# Altium schematic sheet LVM main.SchDoc: LVM PLC setup
size A3; Author: Felipe Besser P.; CompanyName: Observatorio Las Campanas; DocumentNumber: 1; Revision: 1; SheetNumber: 1; SheetTotal: 3
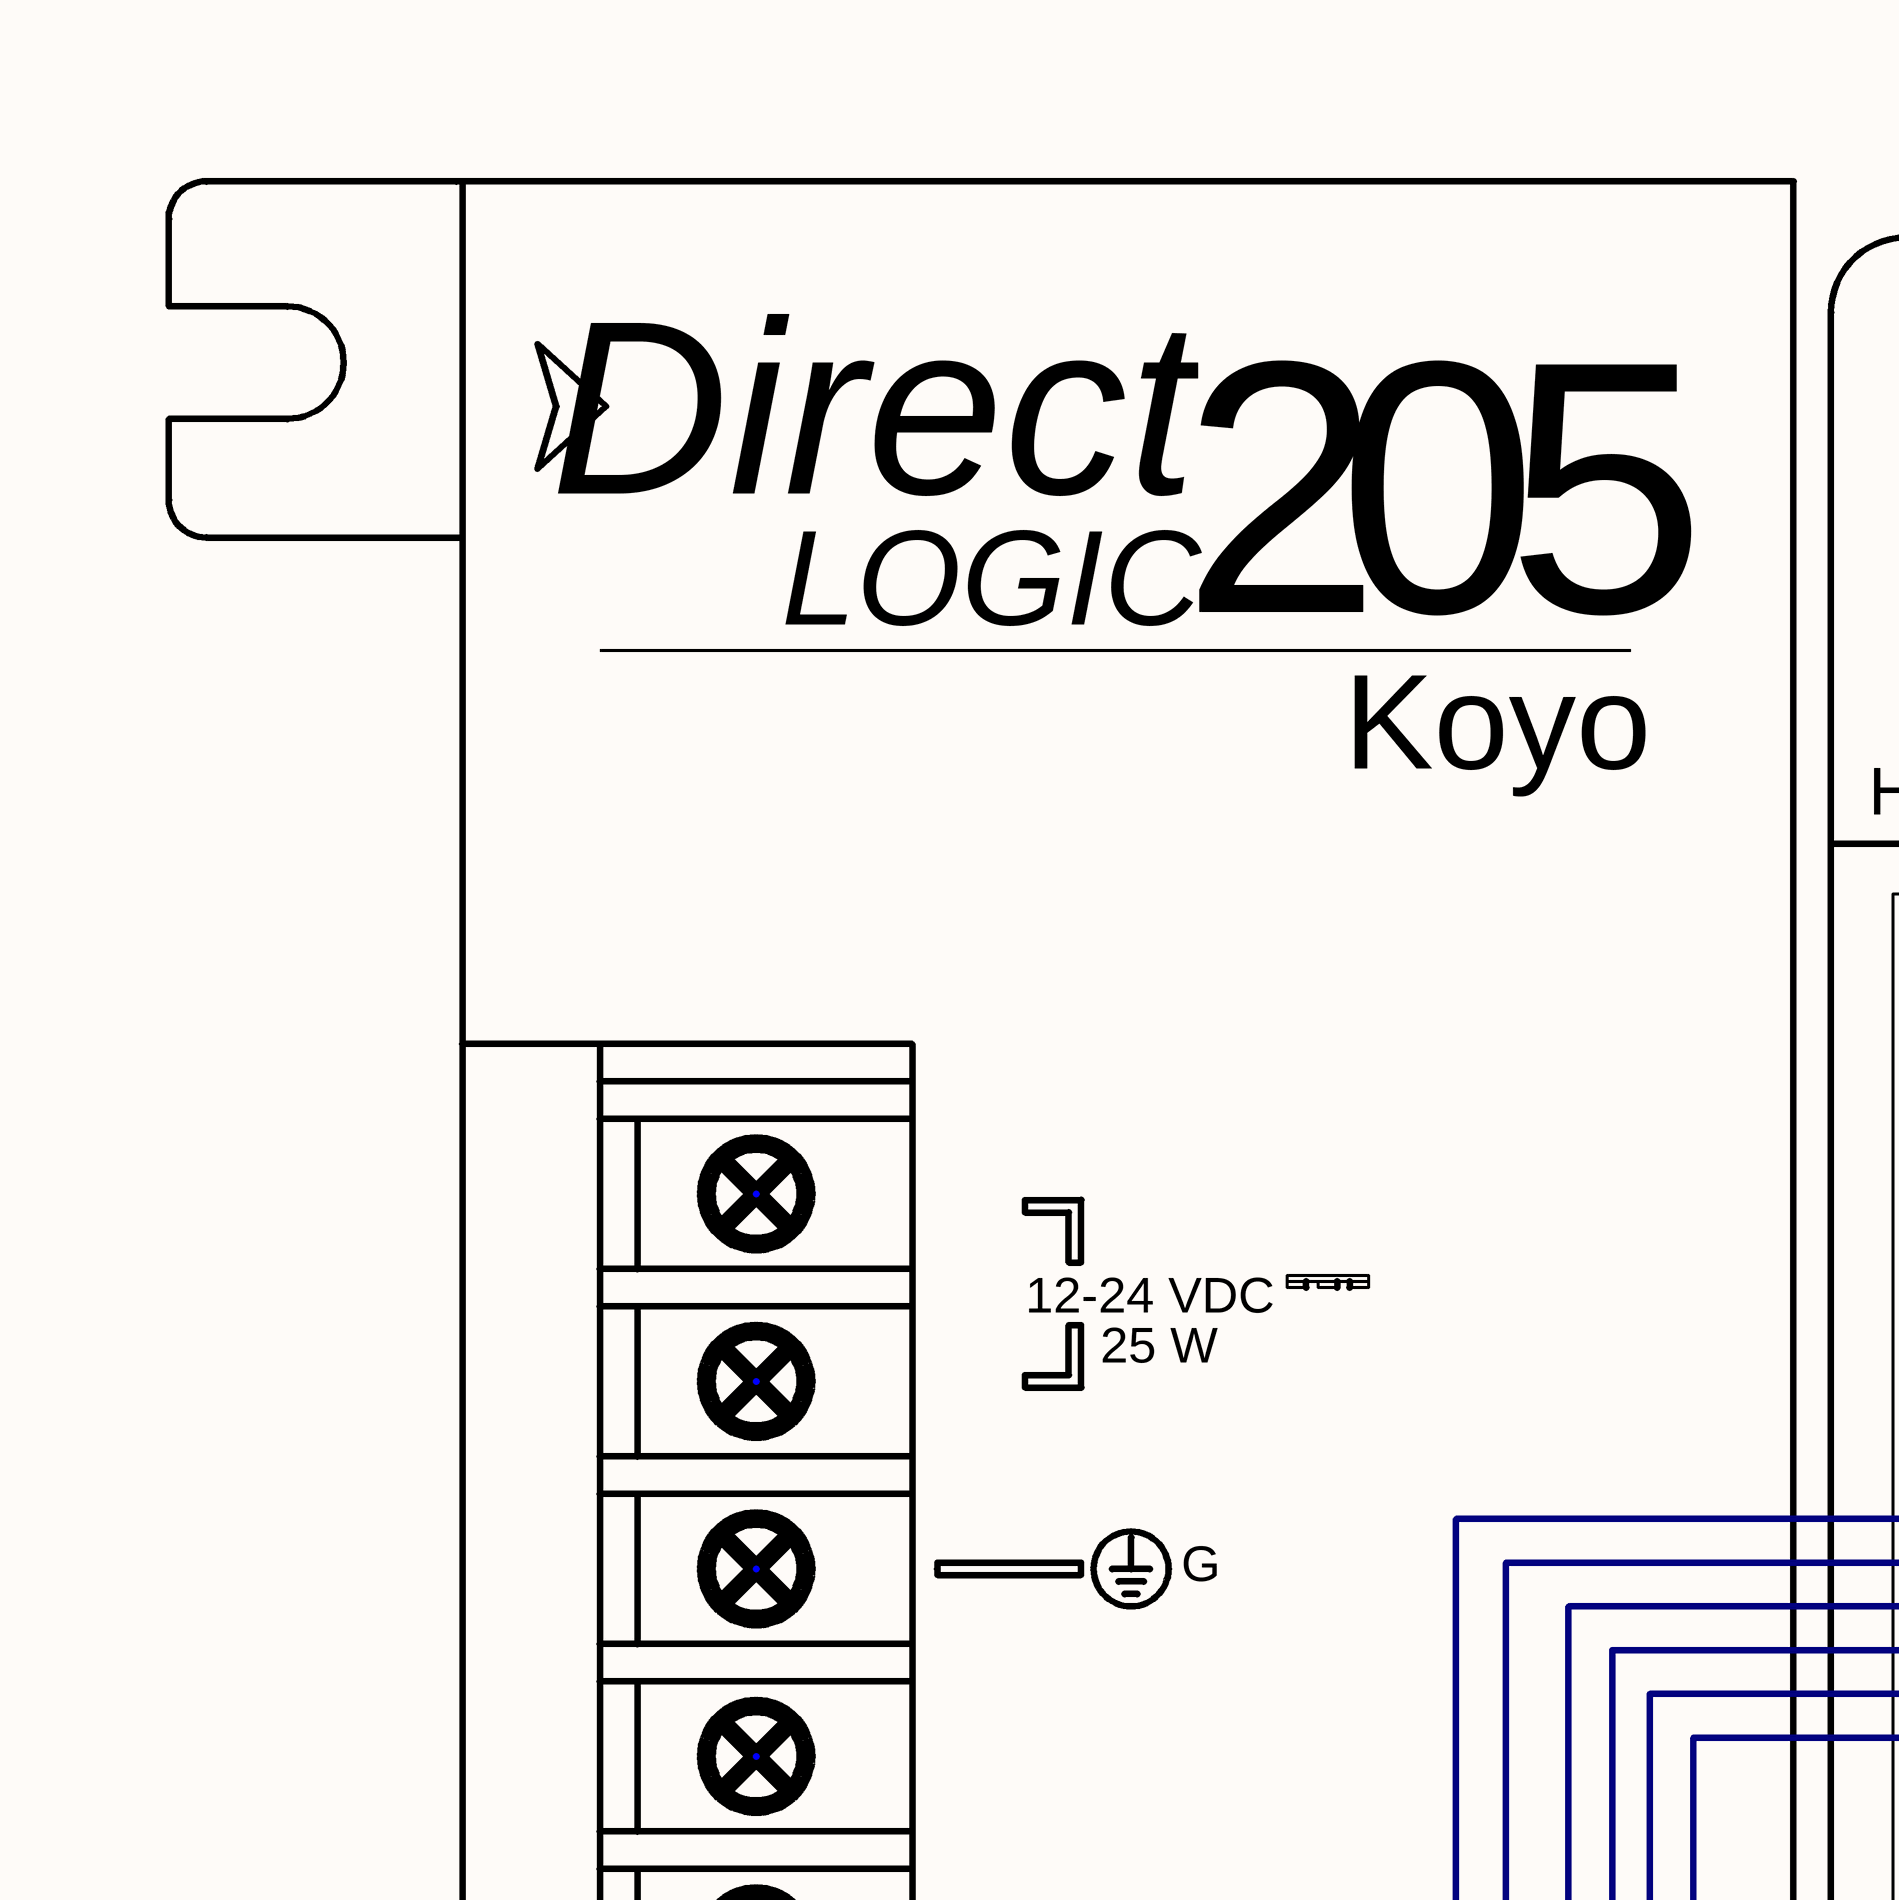
[diagram p0: LVM main.SchDoc, top column 1 of 4]
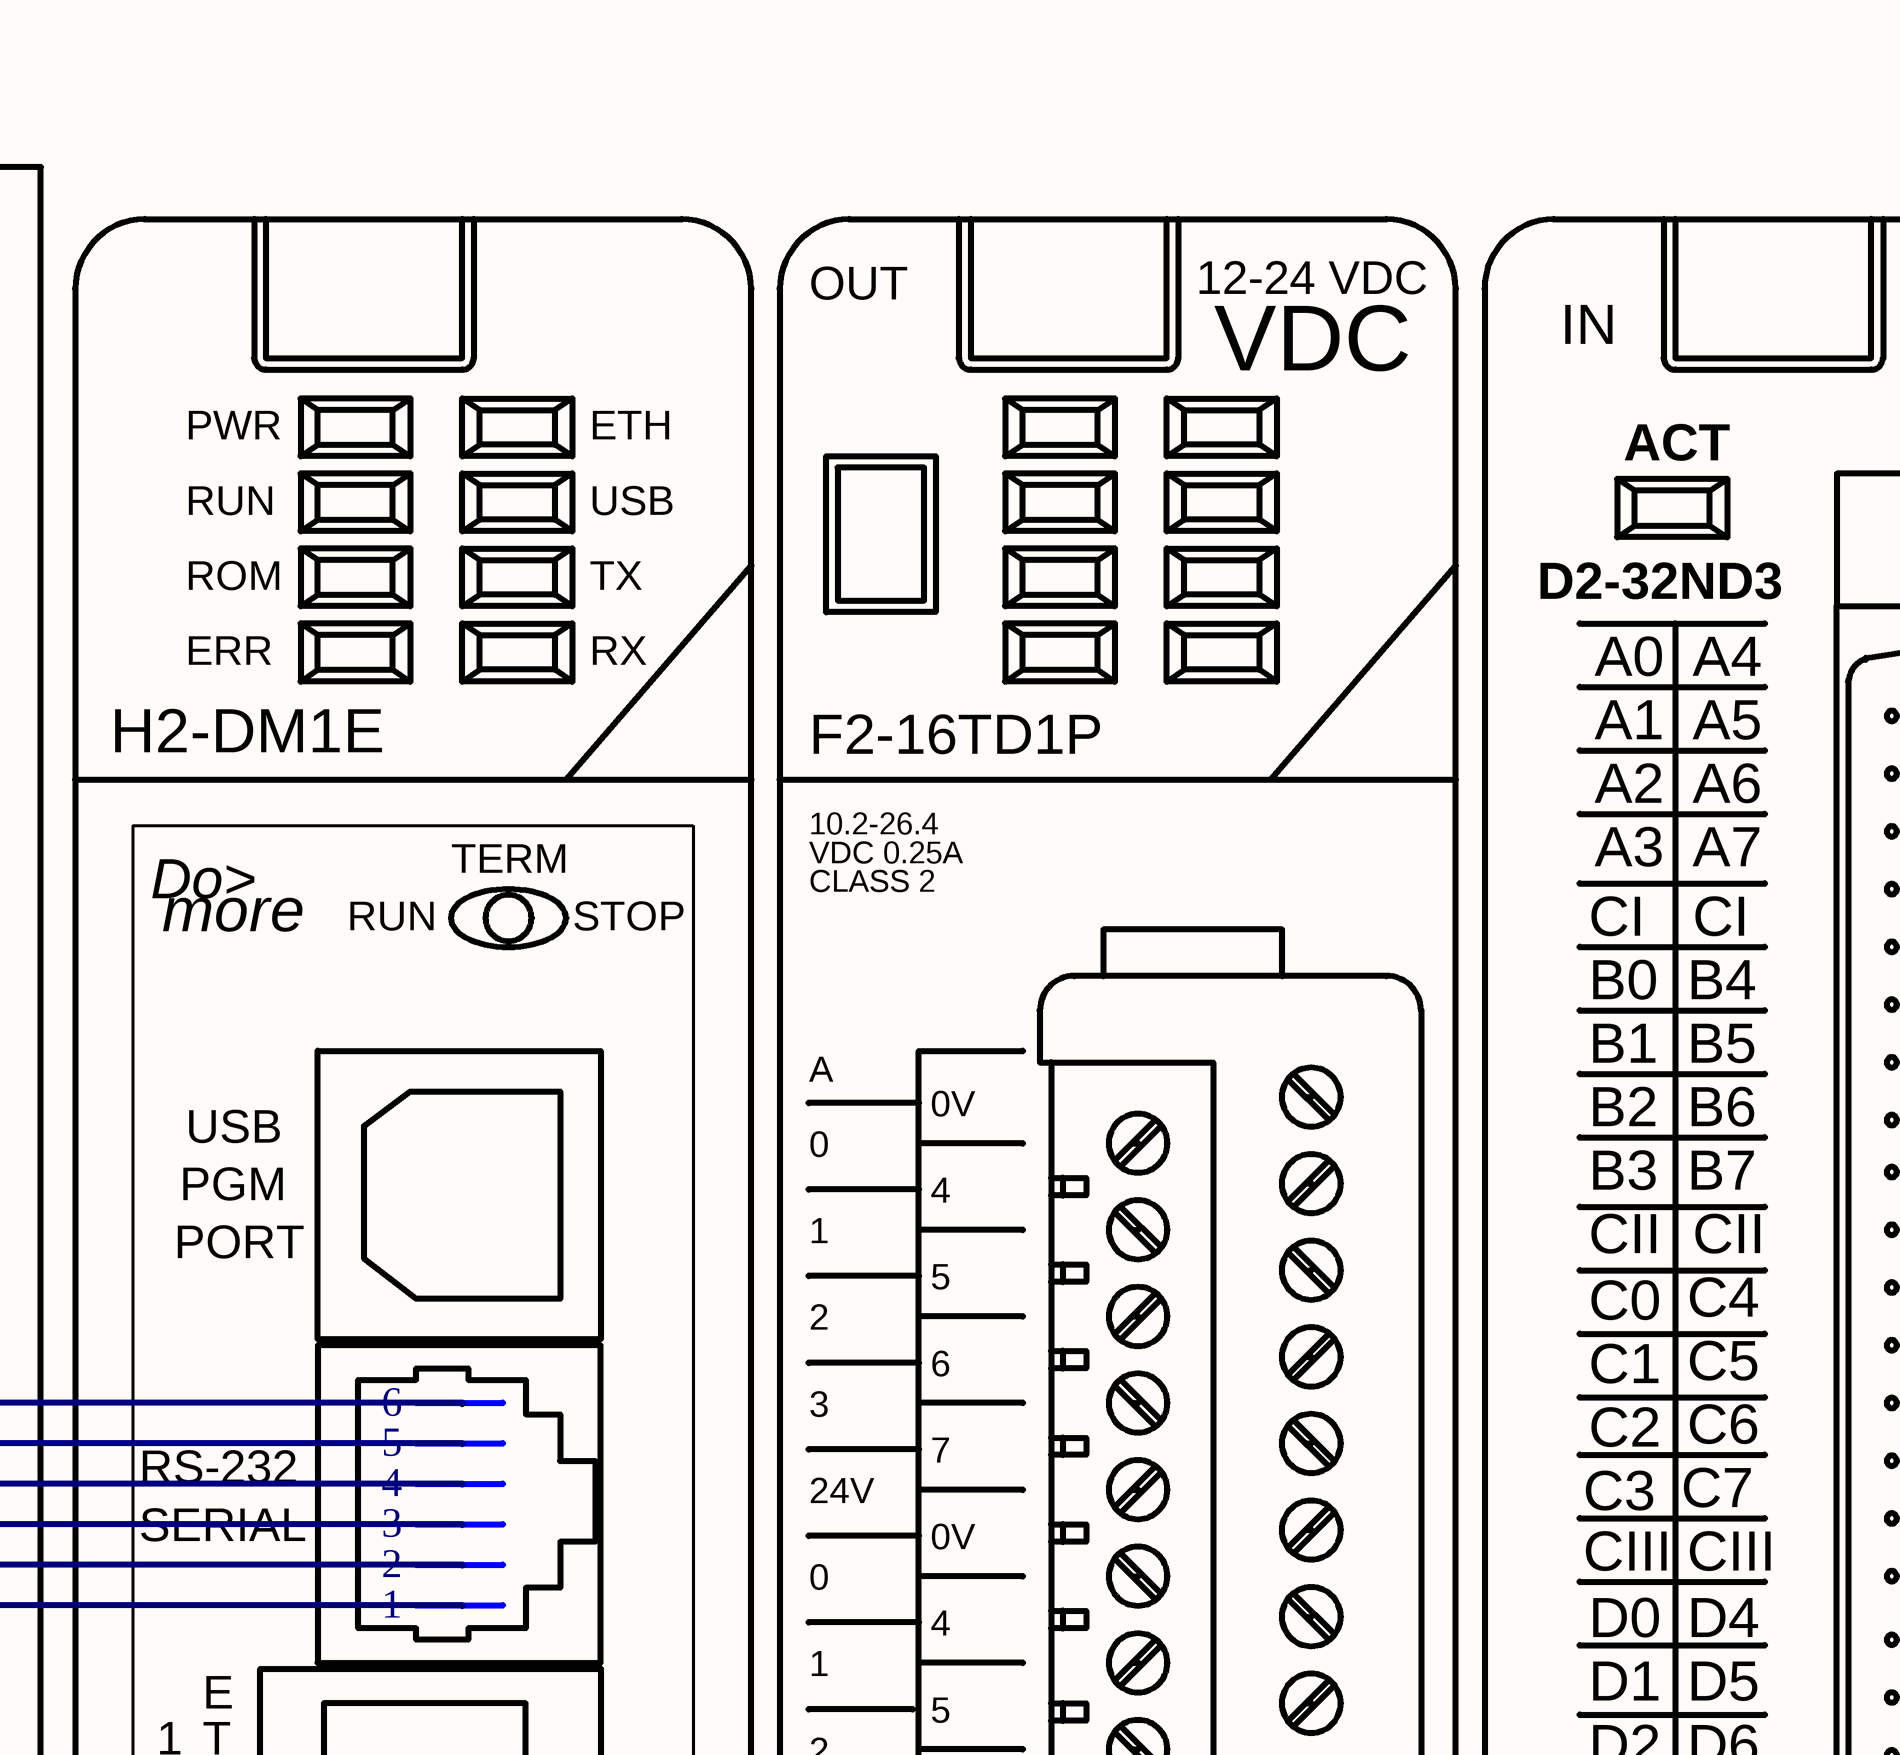
[diagram p1: LVM main.SchDoc, top column 2 of 4]
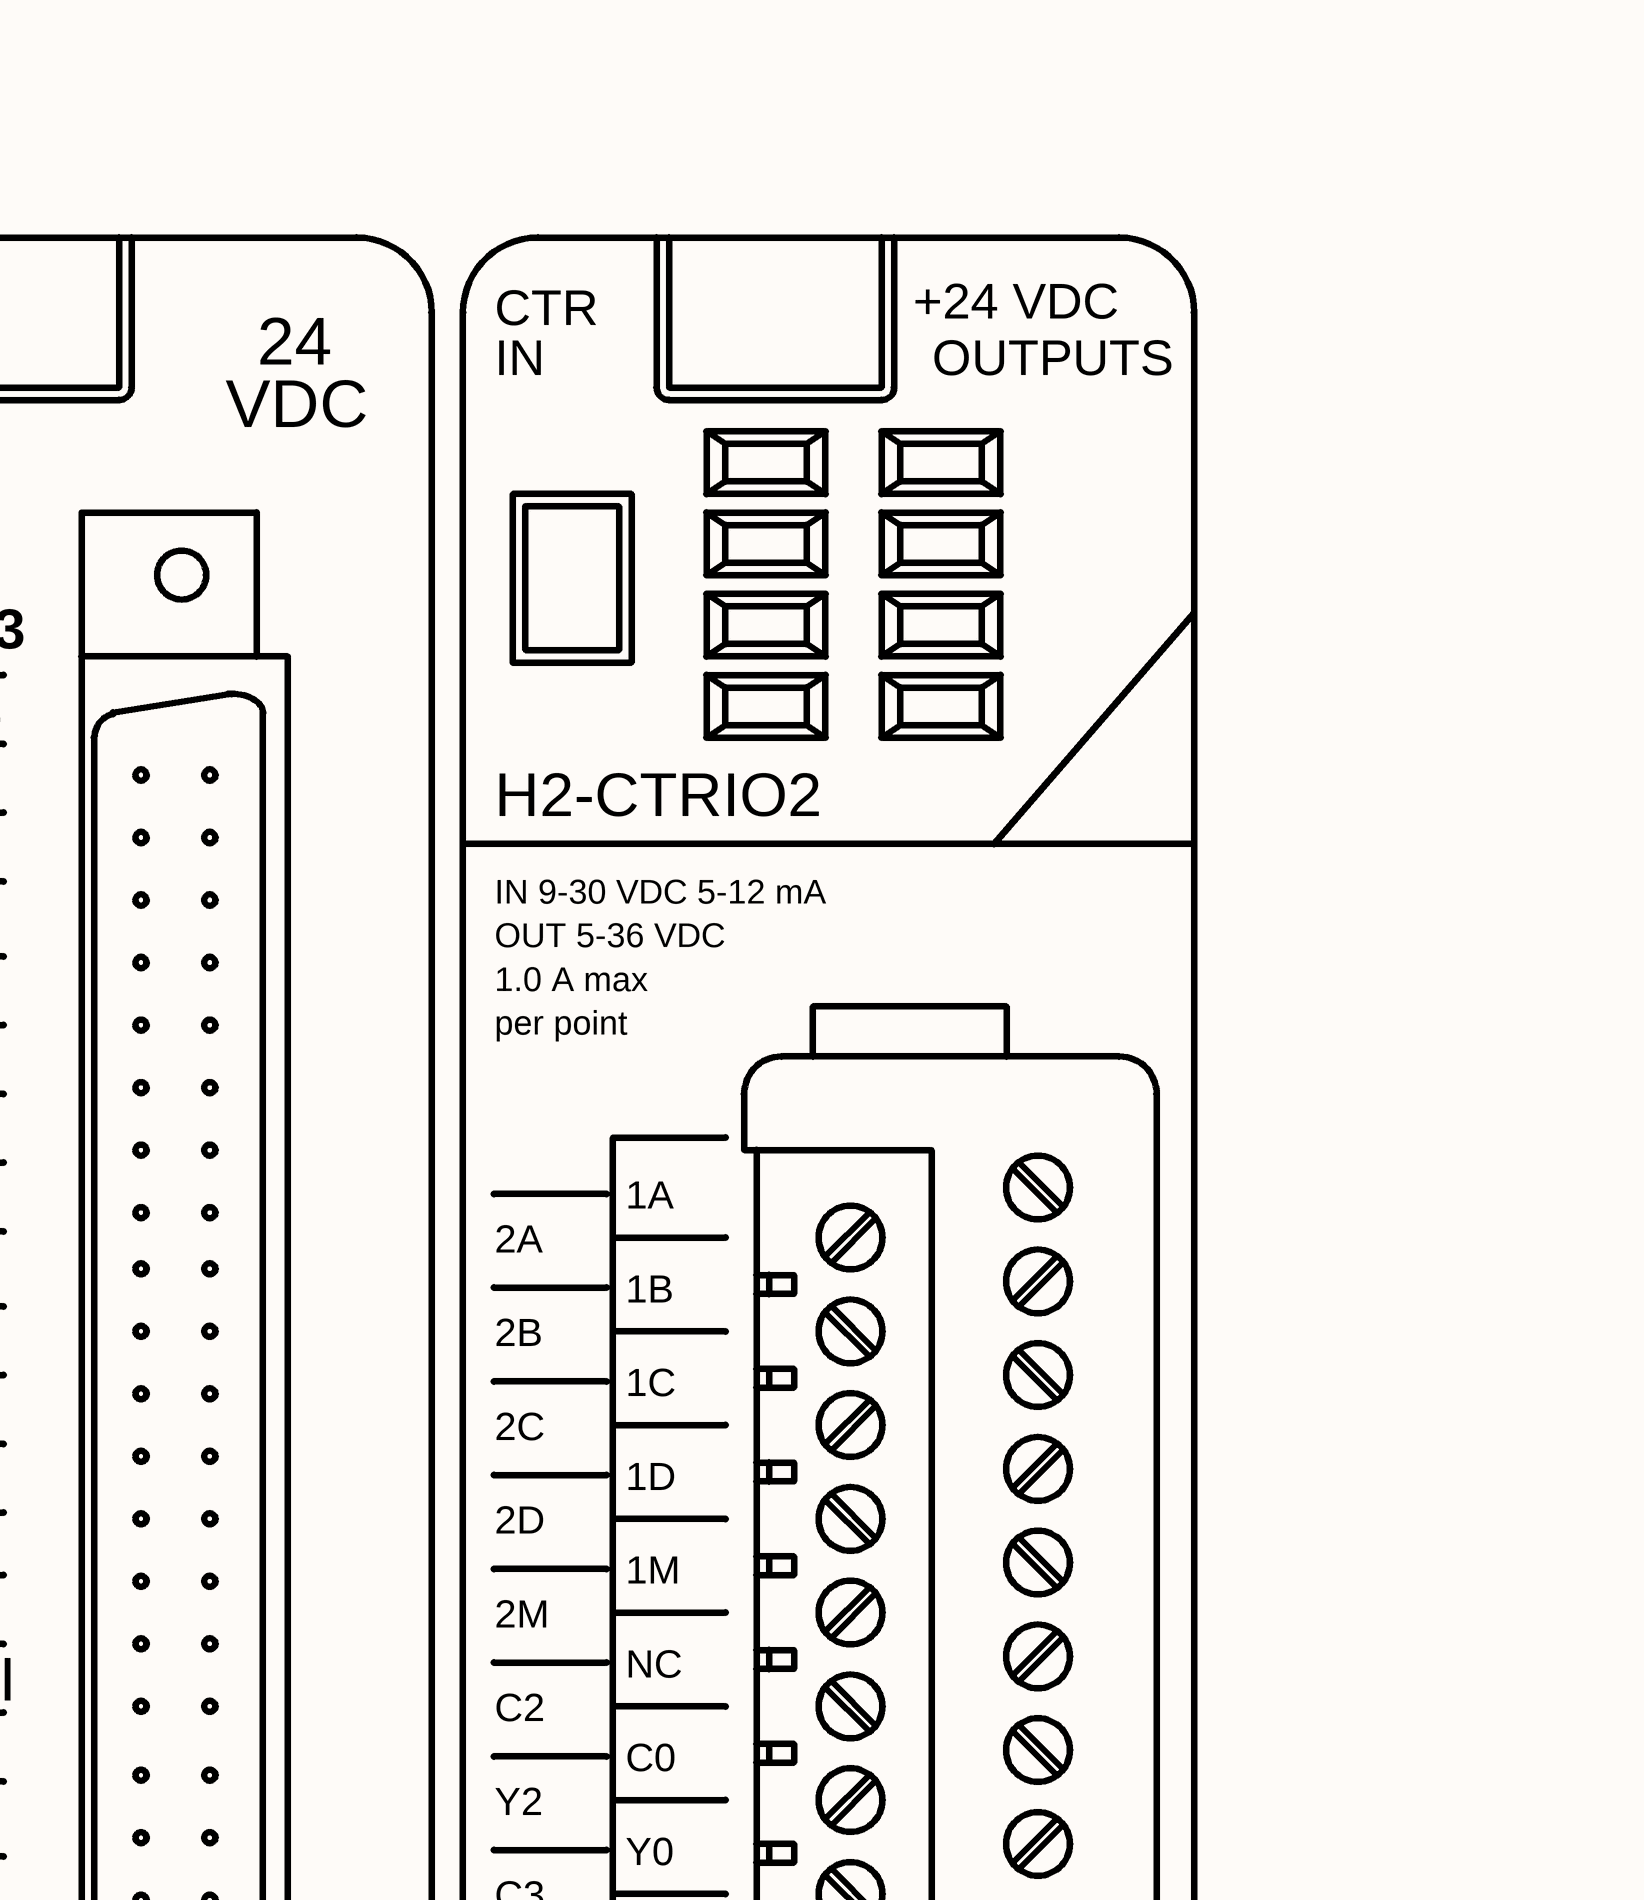
[diagram p2: LVM main.SchDoc, top column 3 of 4]
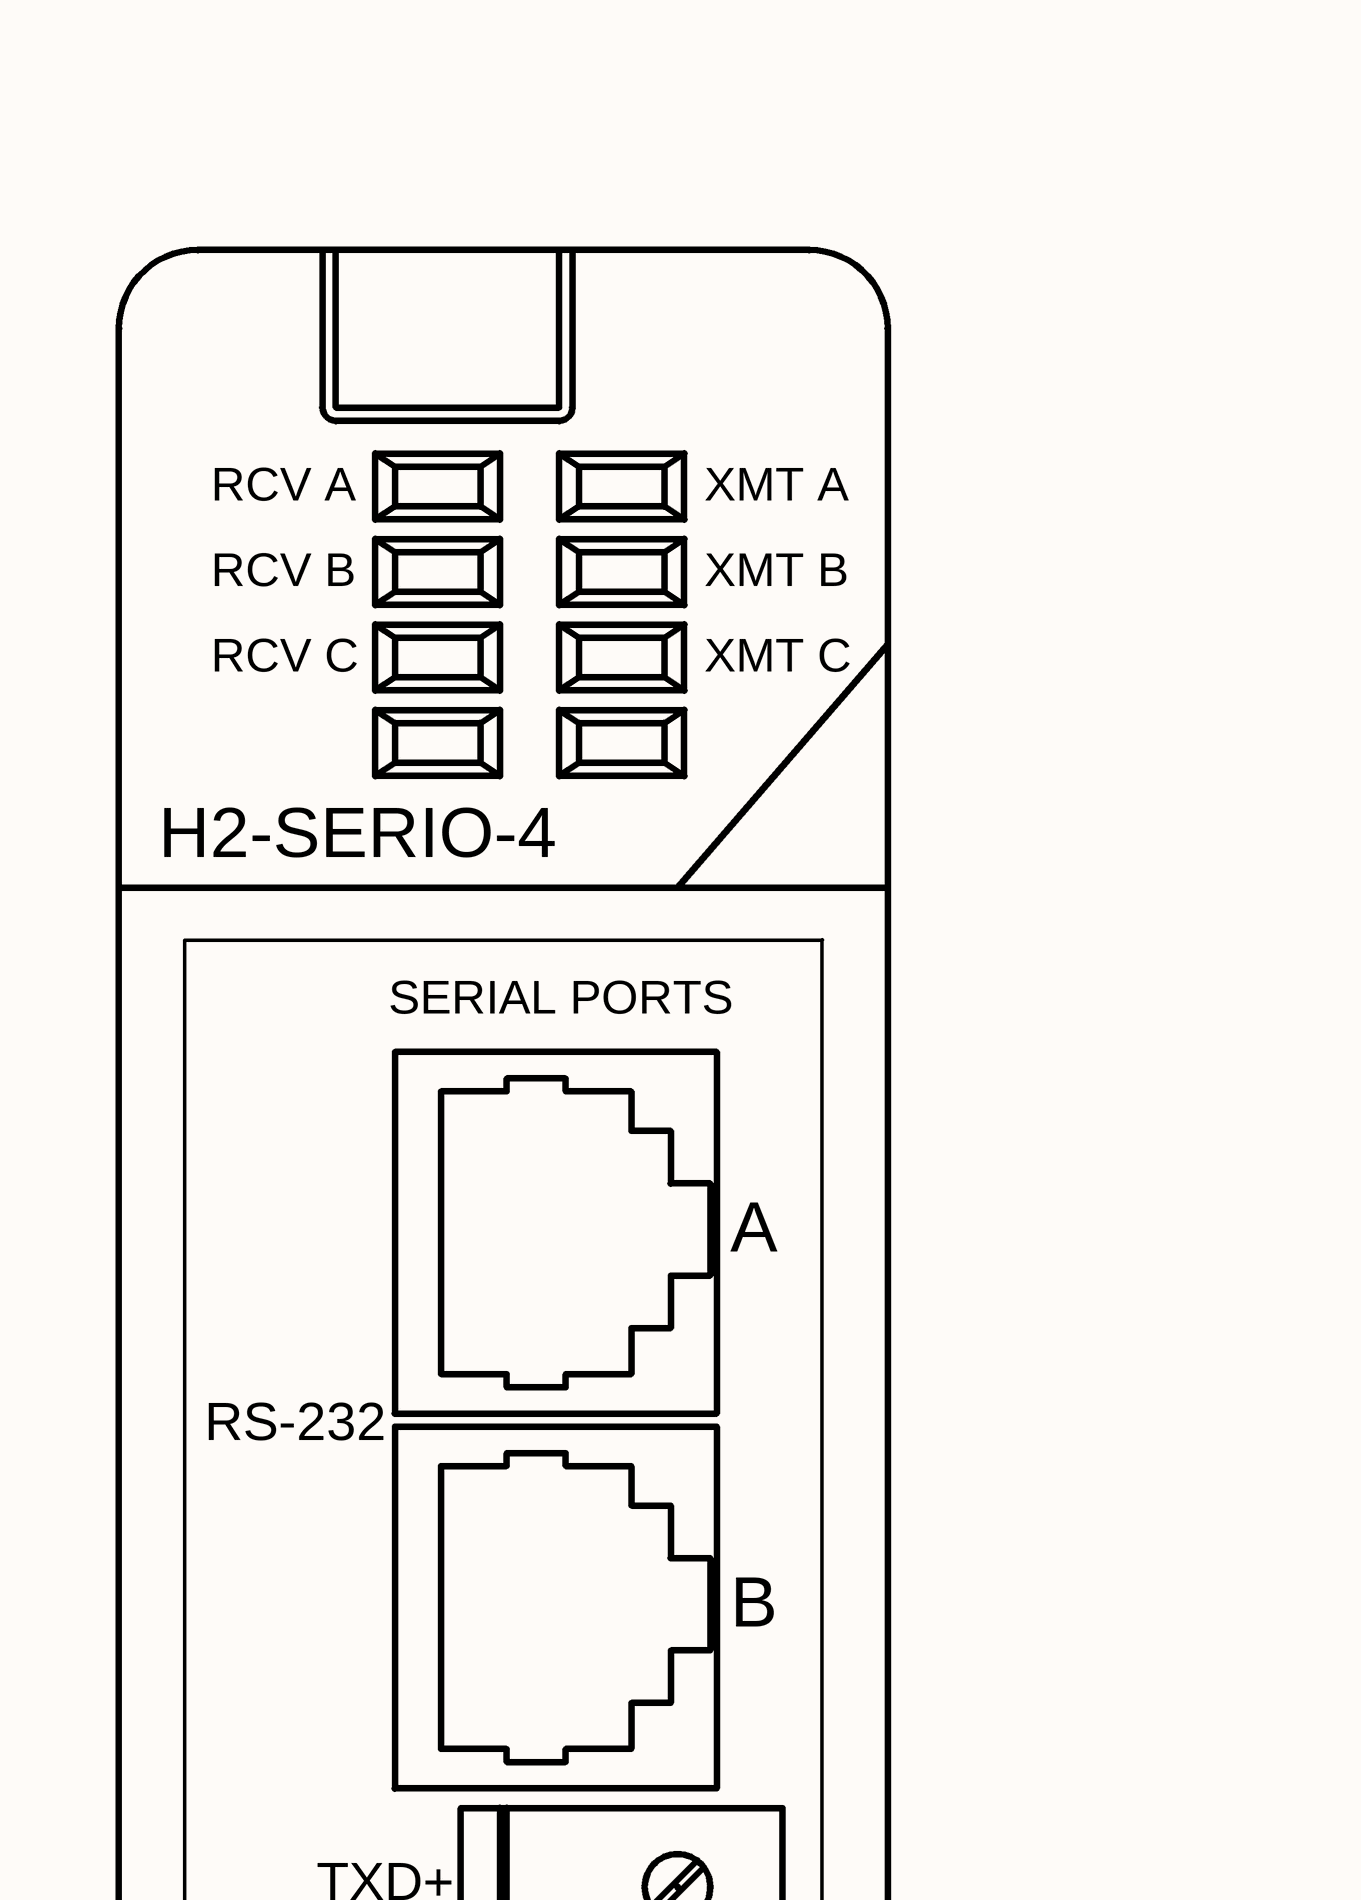
[diagram p3: LVM main.SchDoc, top column 4 of 4]
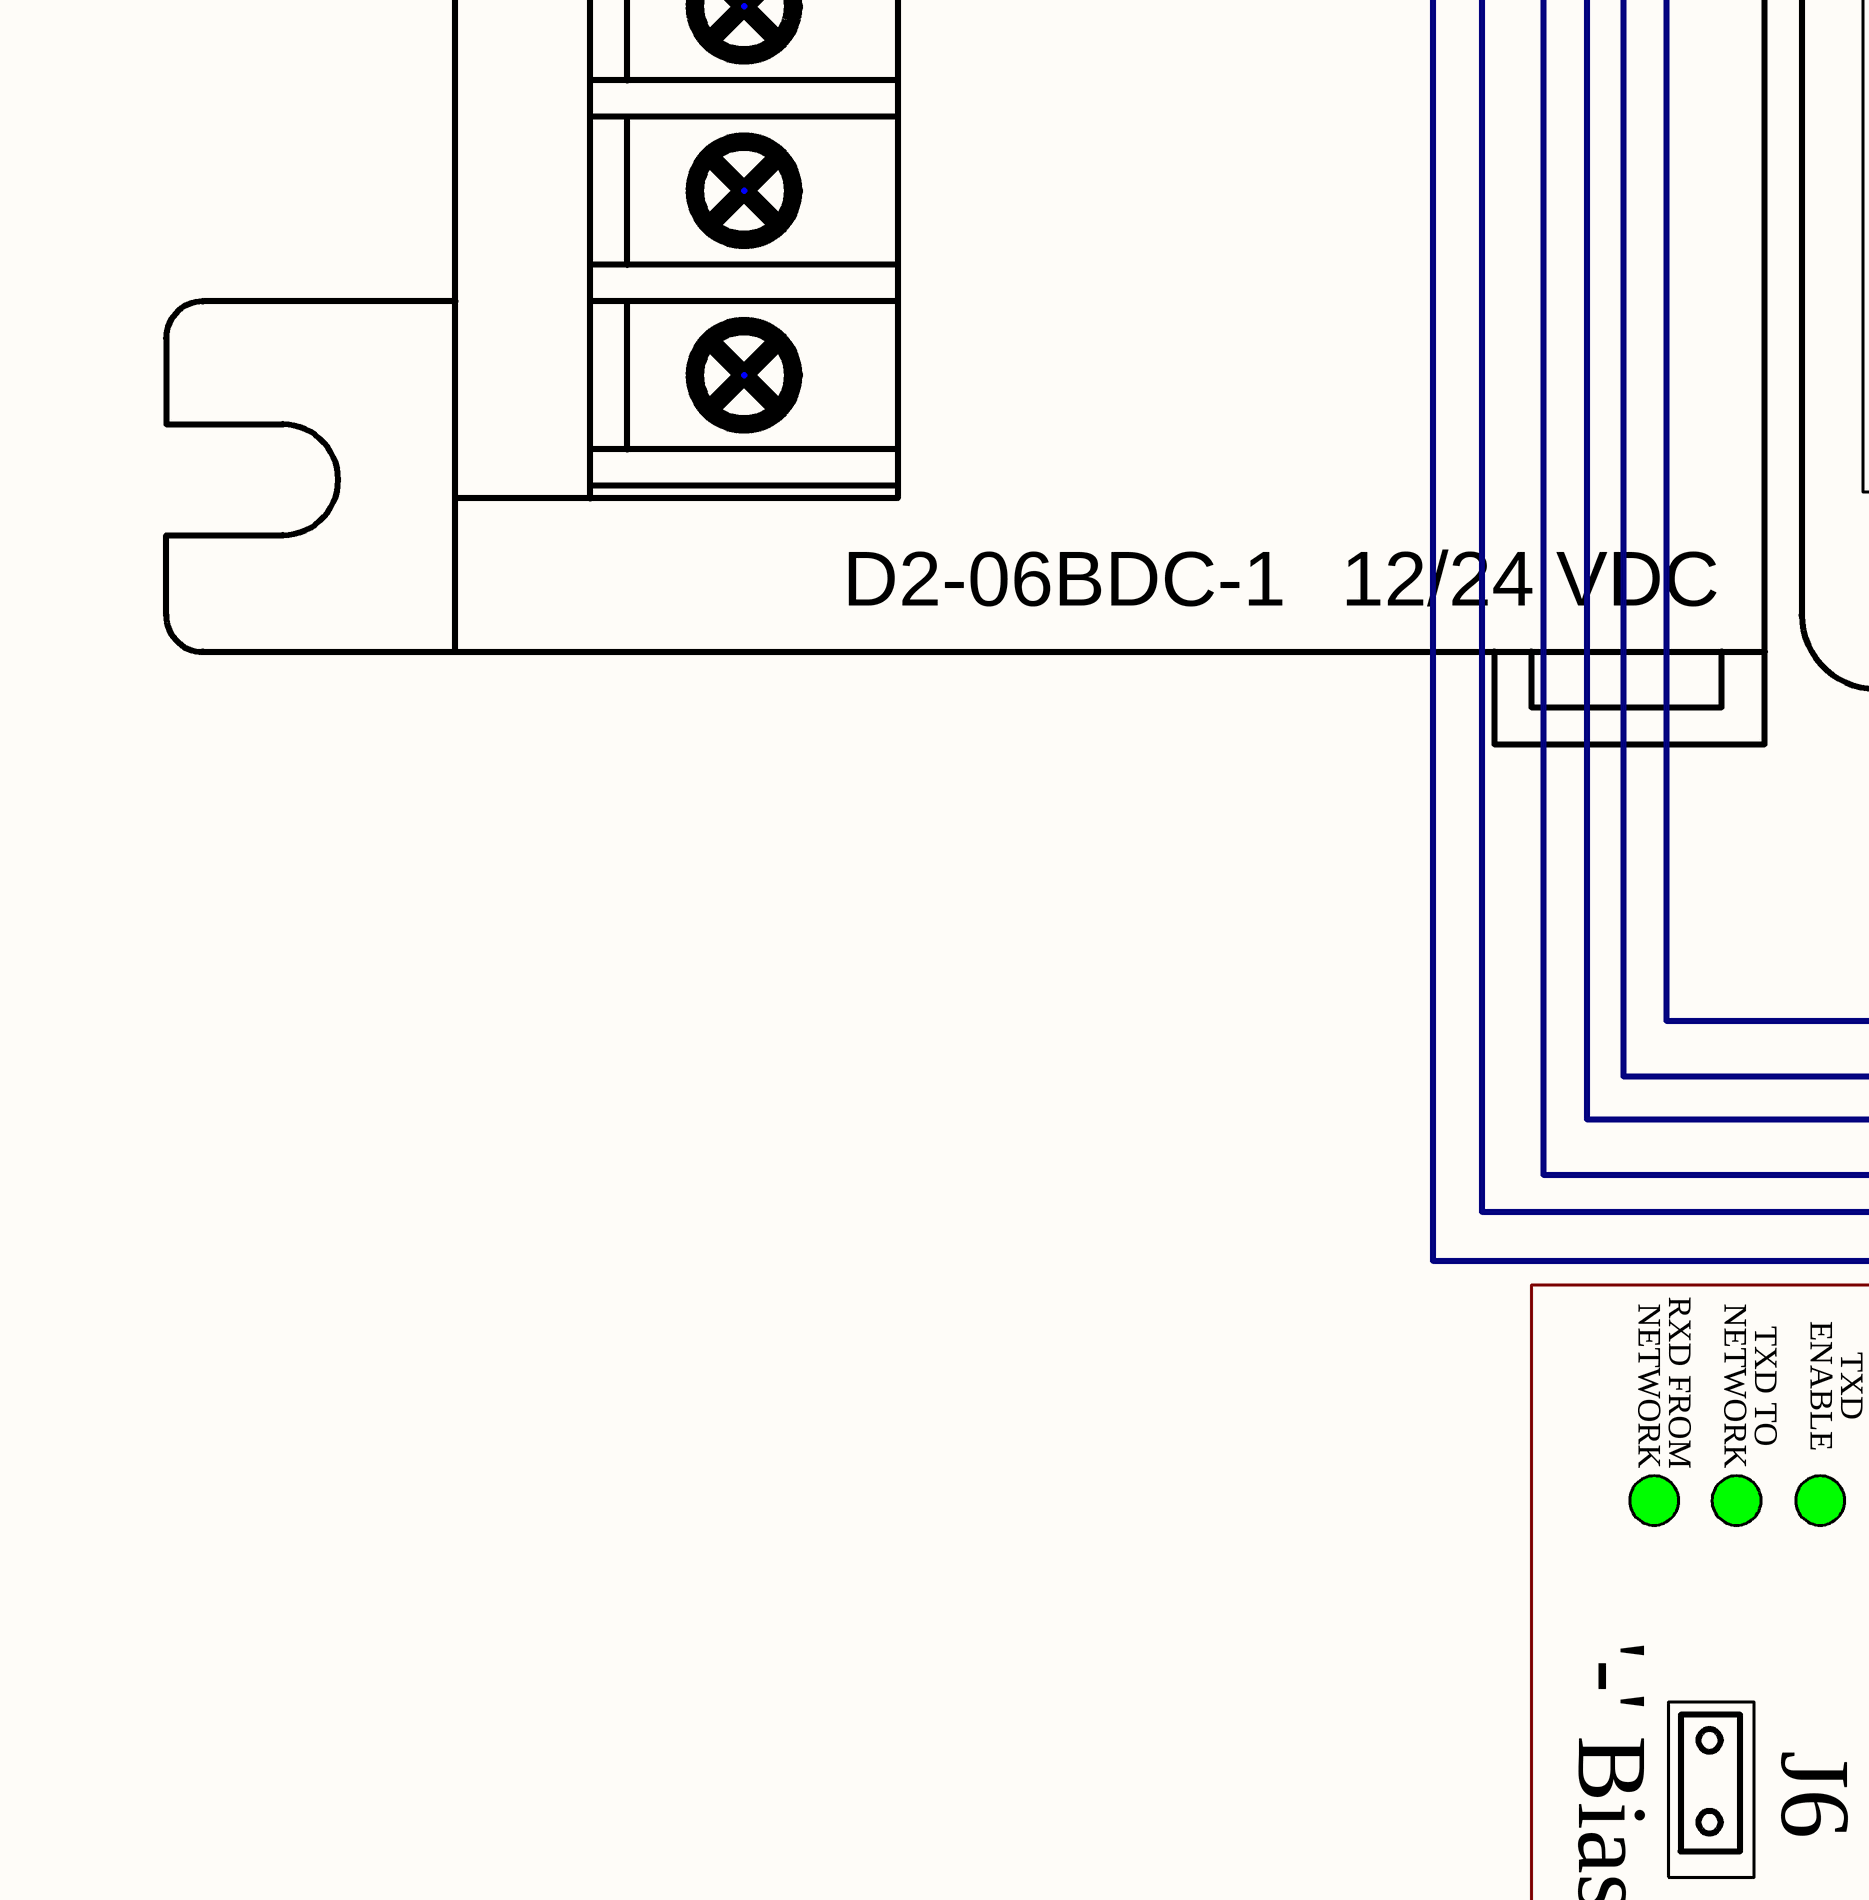
[diagram p4: LVM main.SchDoc, centre column 1 of 4]
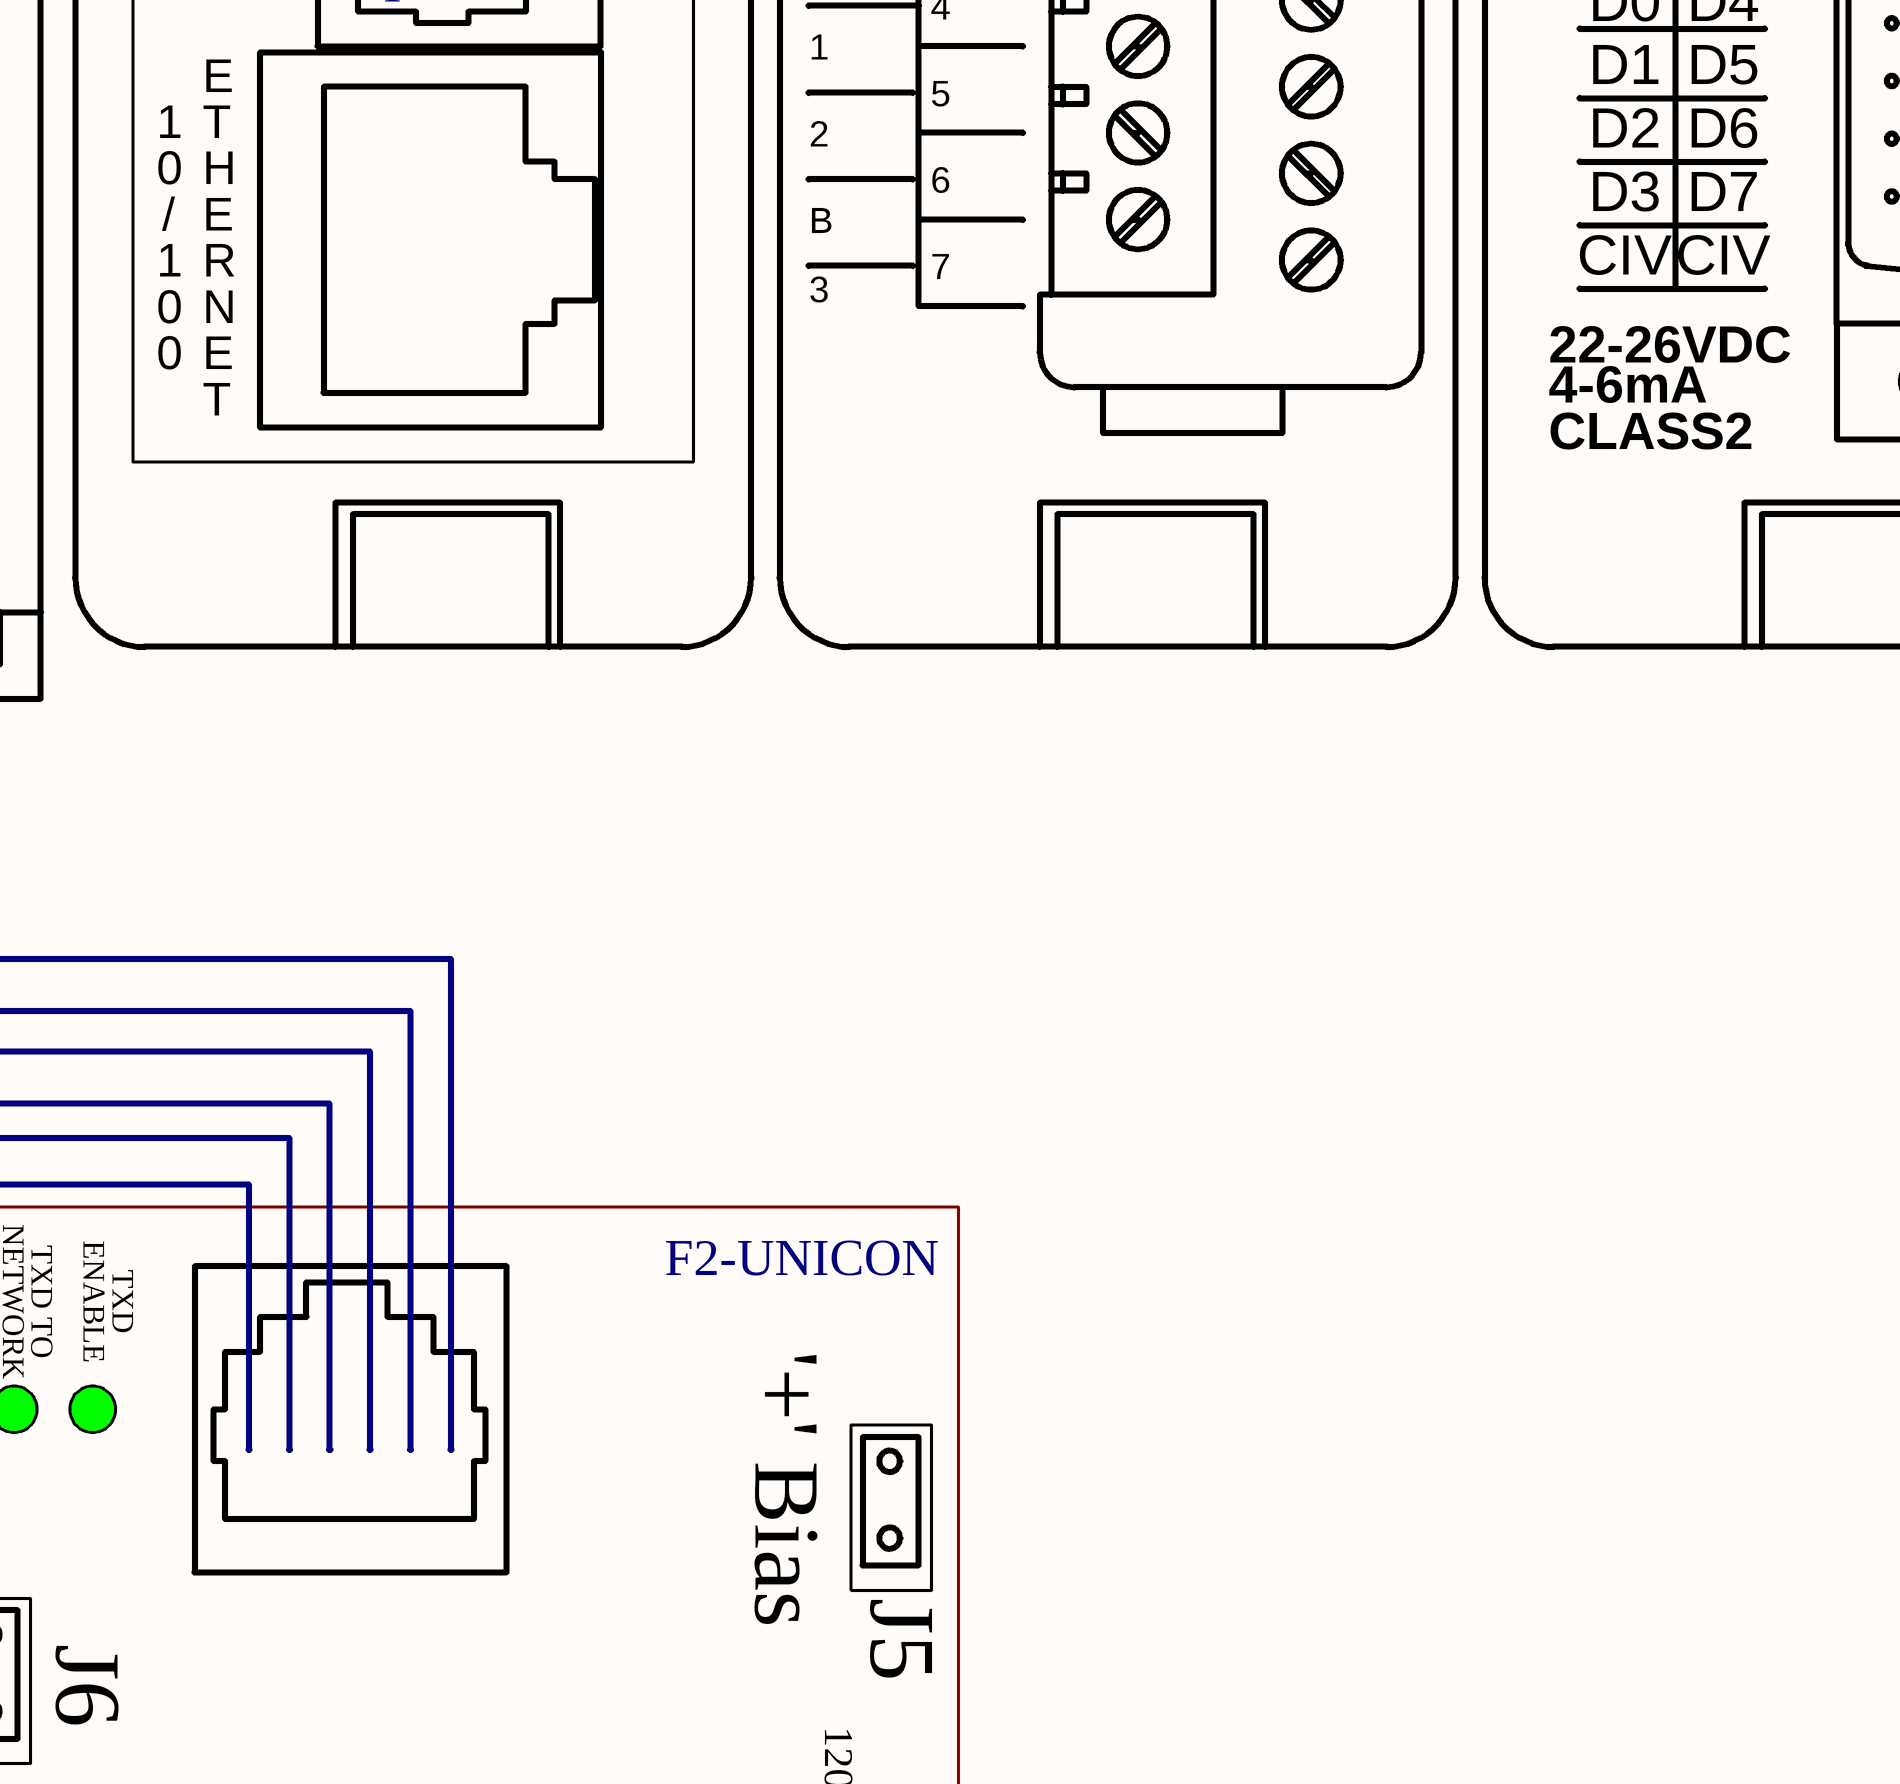
[diagram p5: LVM main.SchDoc, centre column 2 of 4]
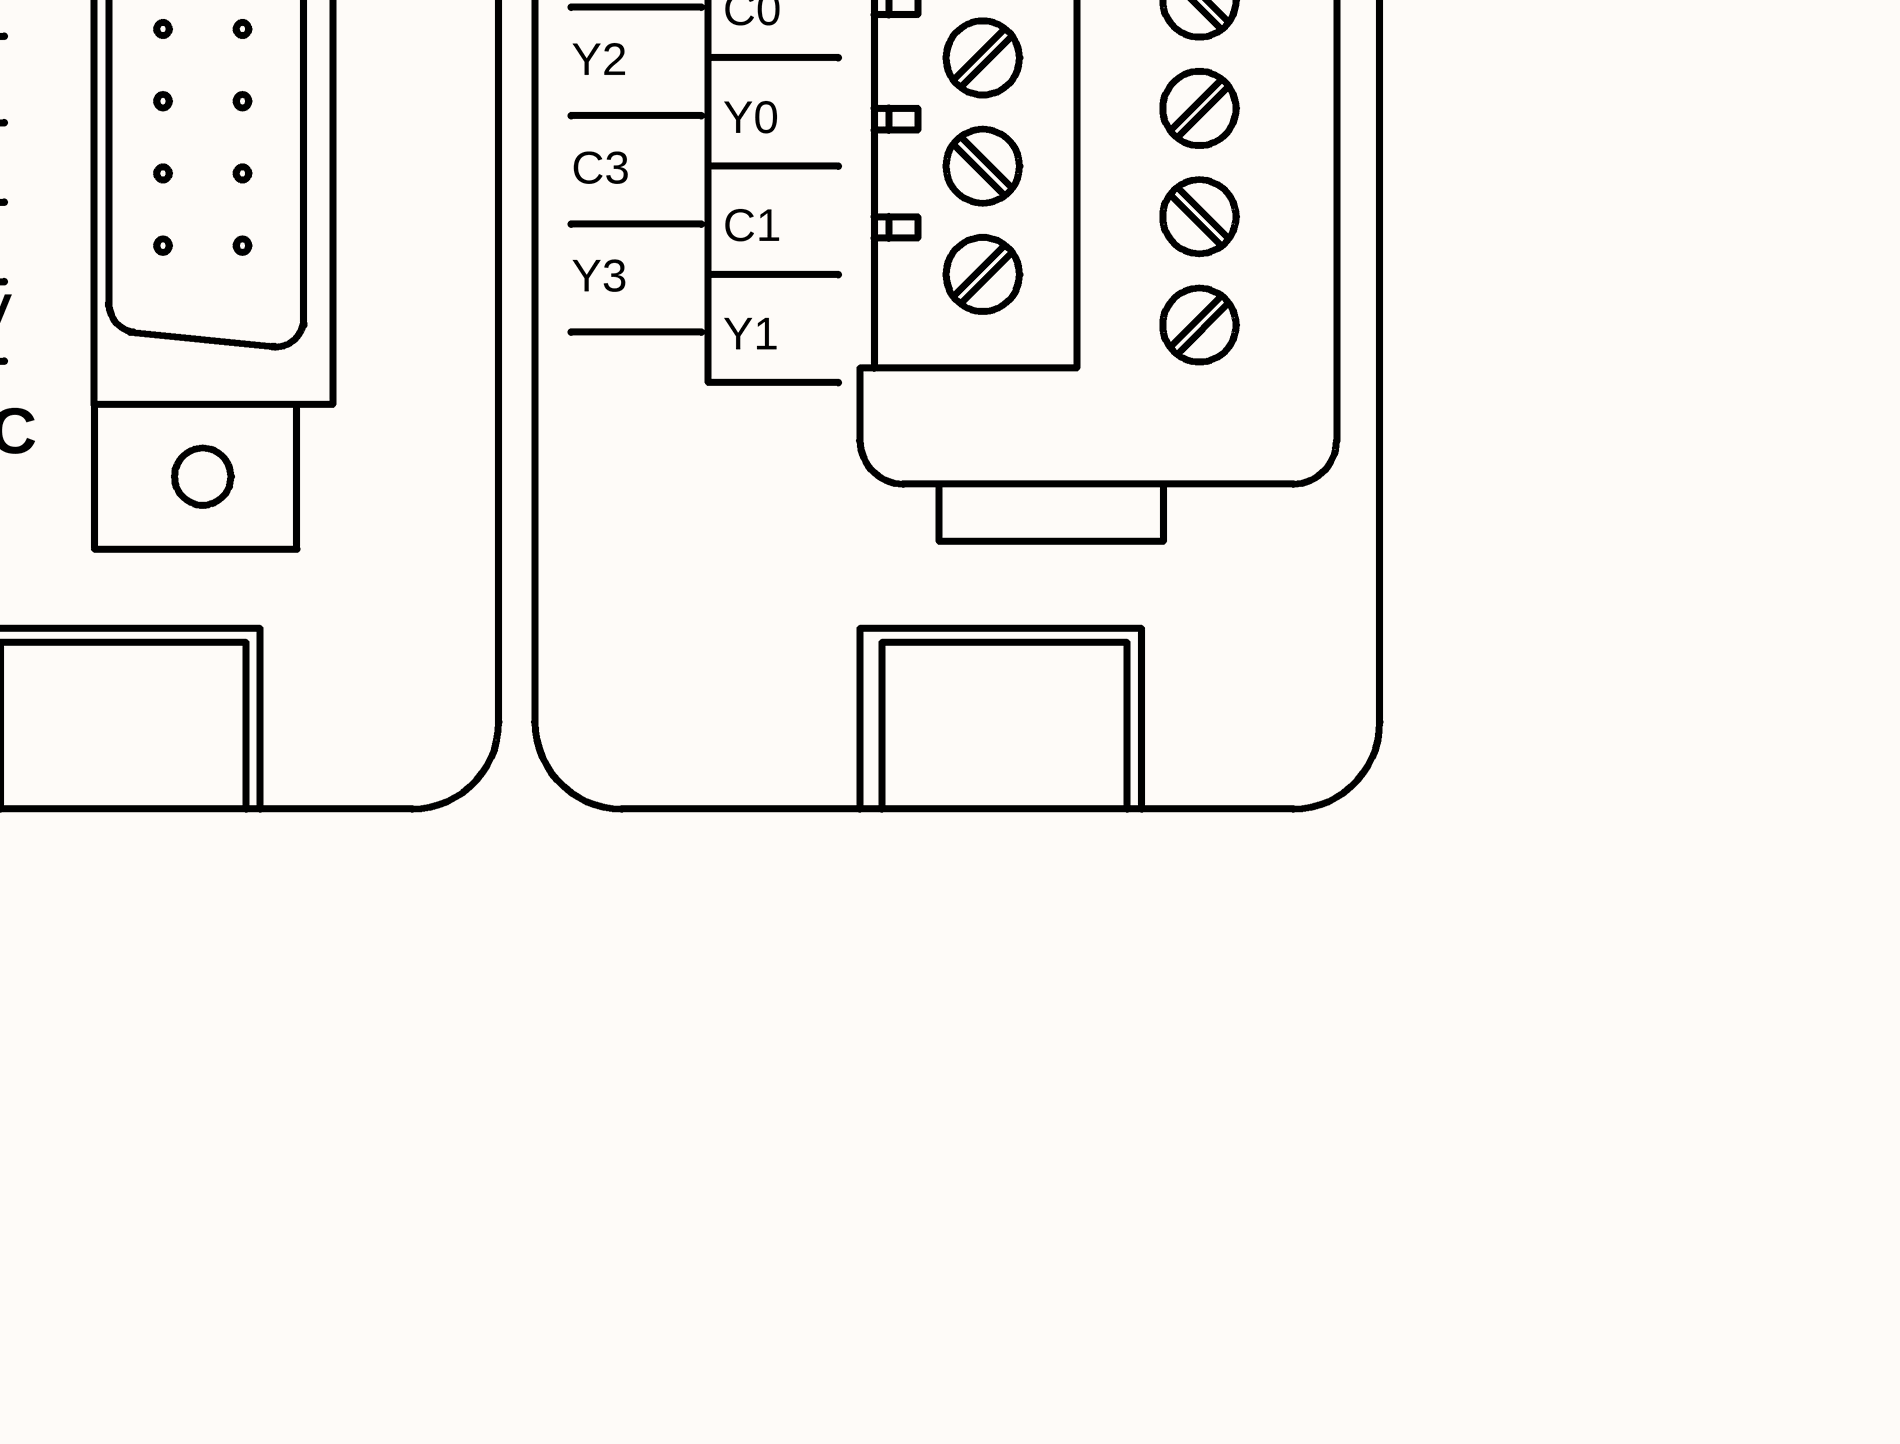
[diagram p6: LVM main.SchDoc, centre column 3 of 4]
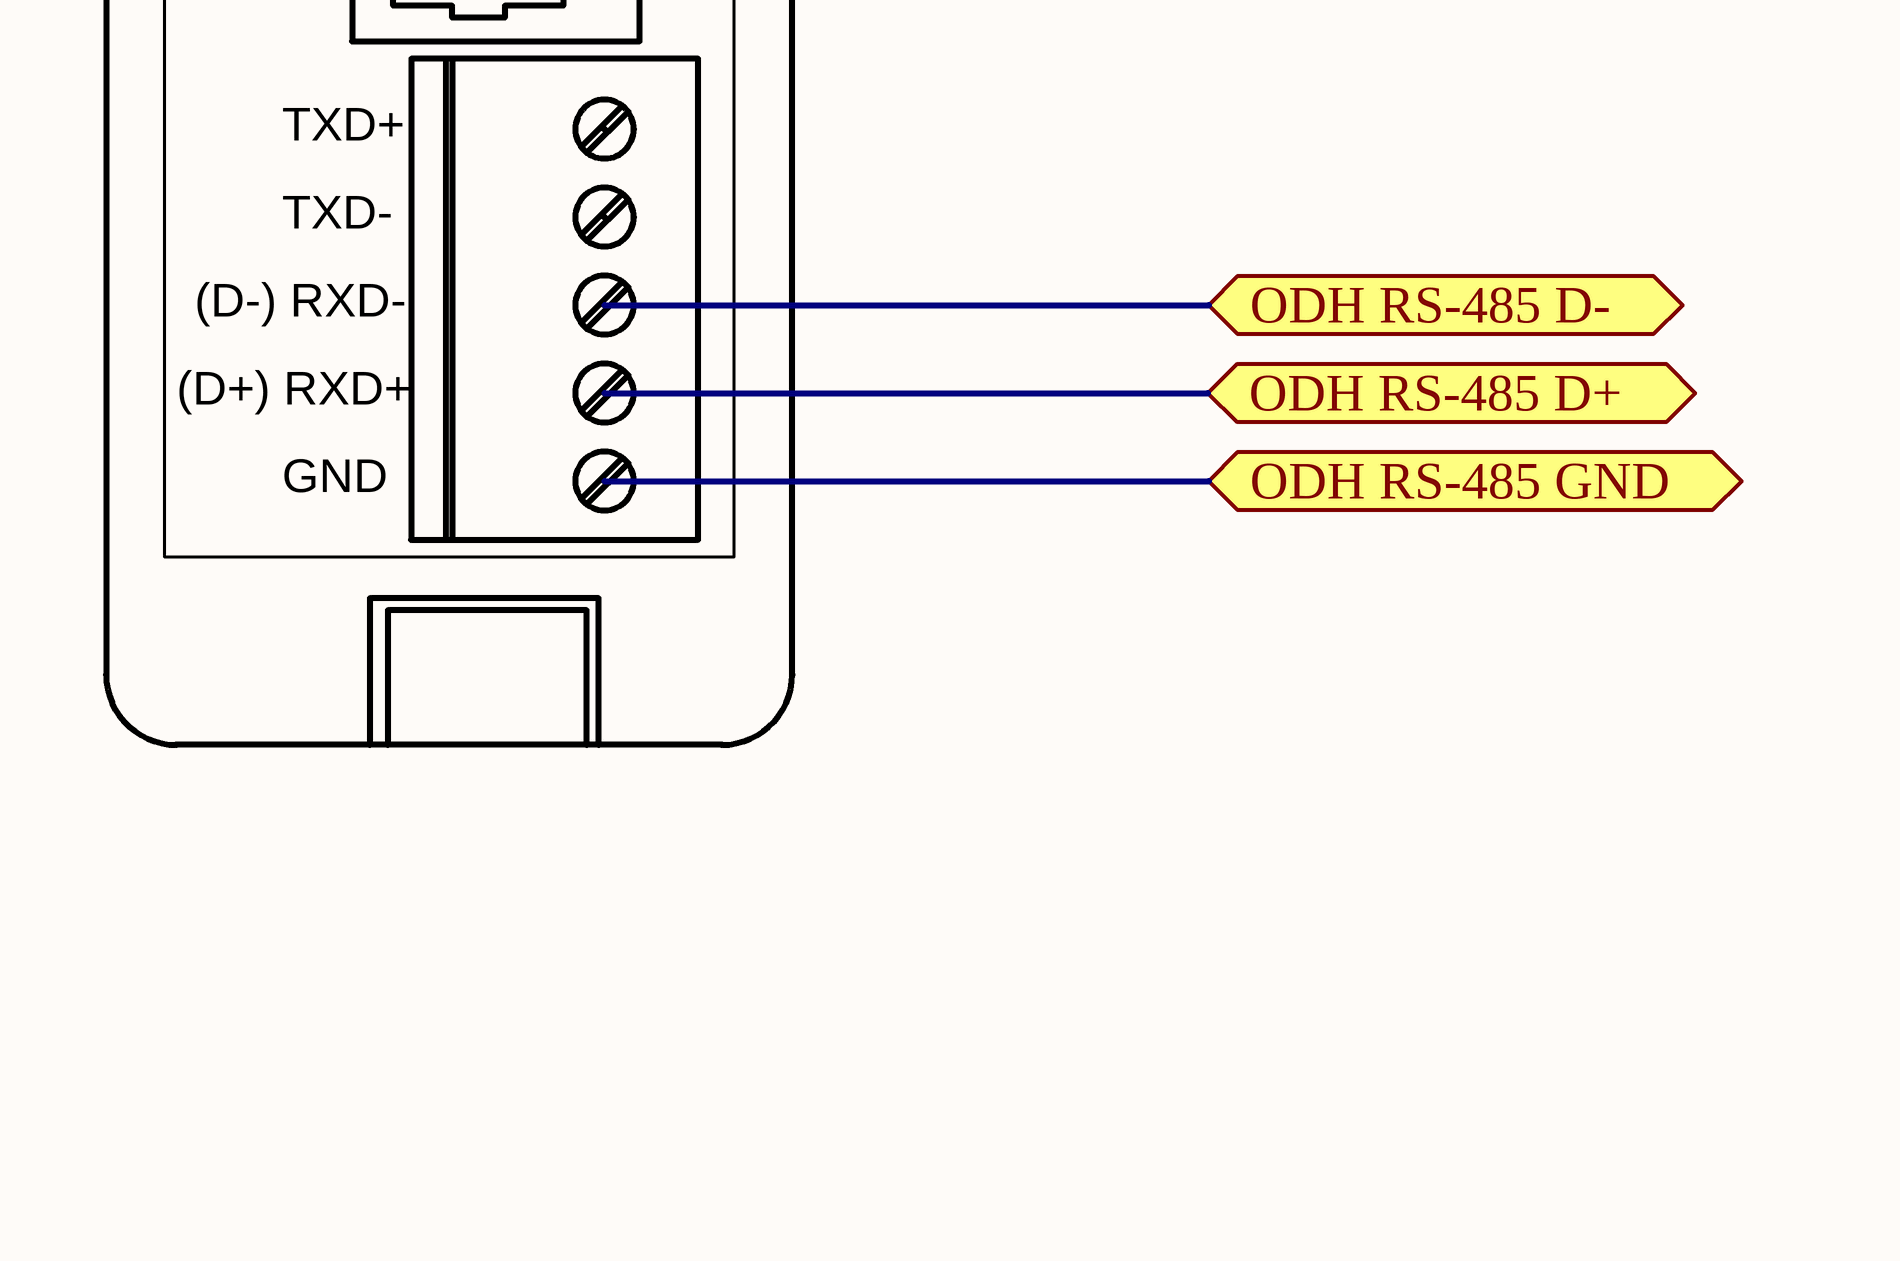
[diagram p7: LVM main.SchDoc, centre column 4 of 4]
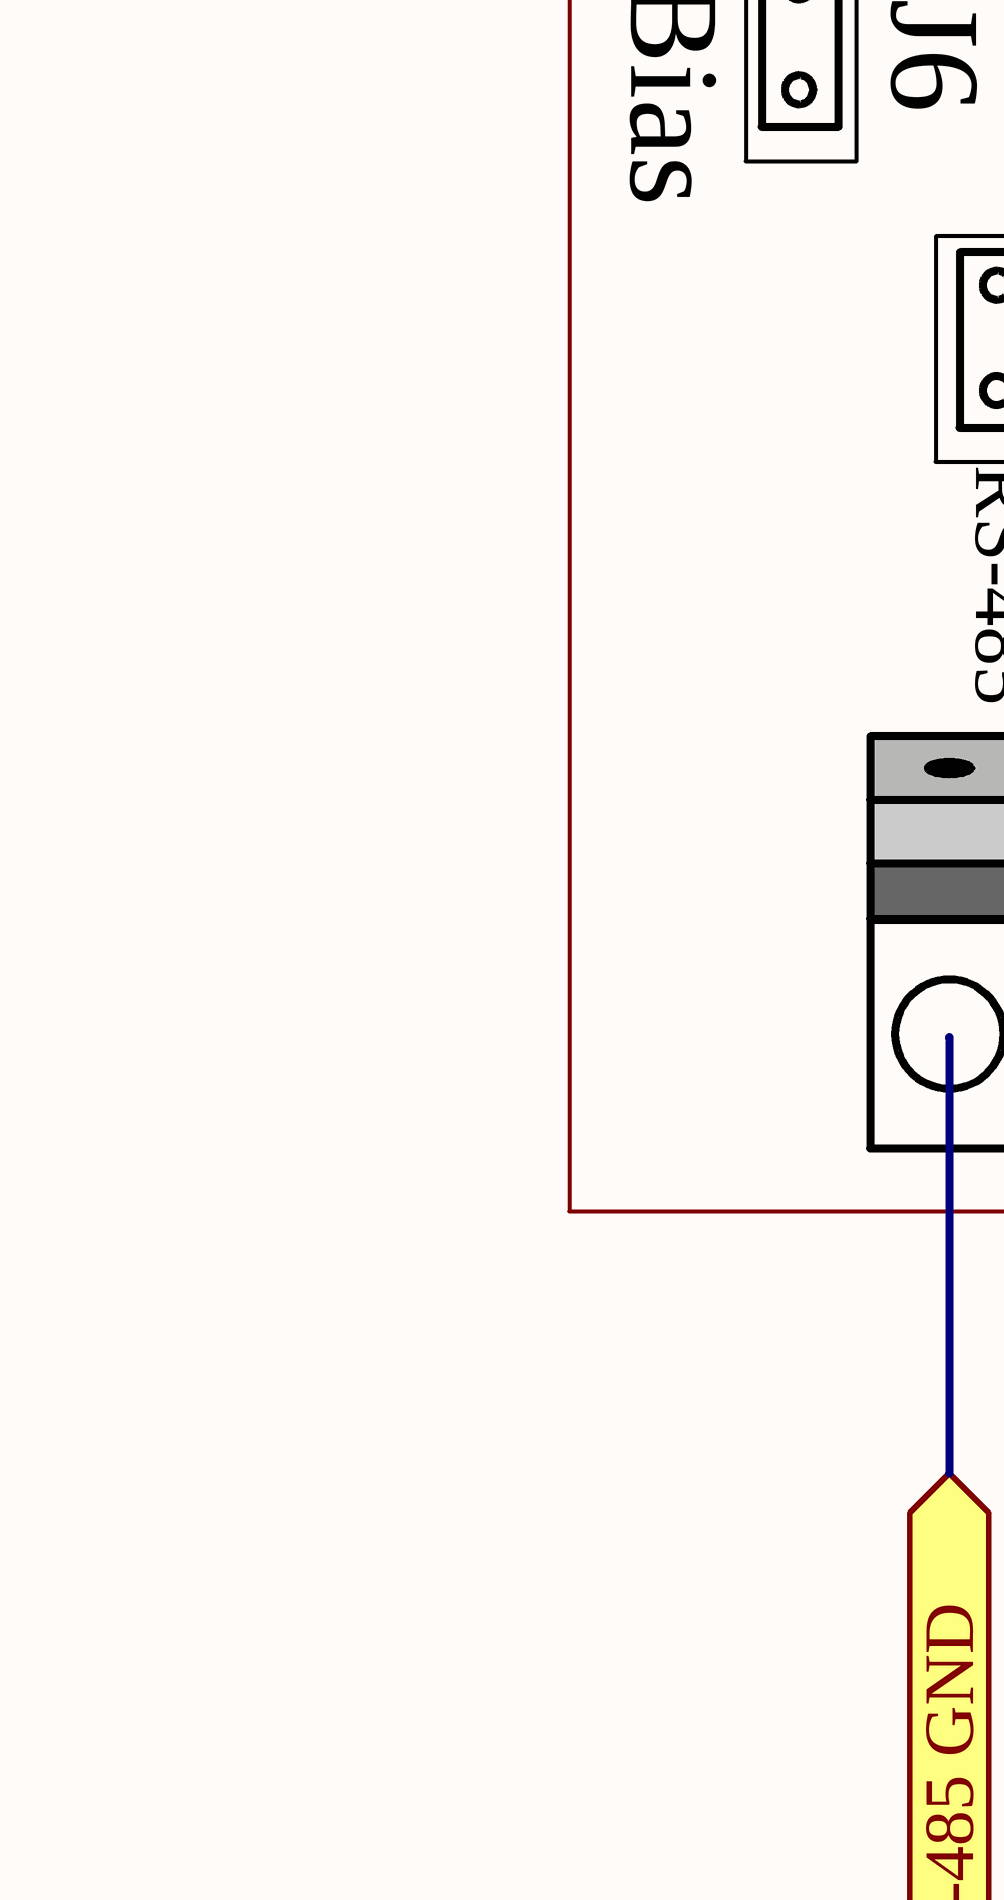
[diagram p8: LVM main.SchDoc, bottom column 1 of 4]
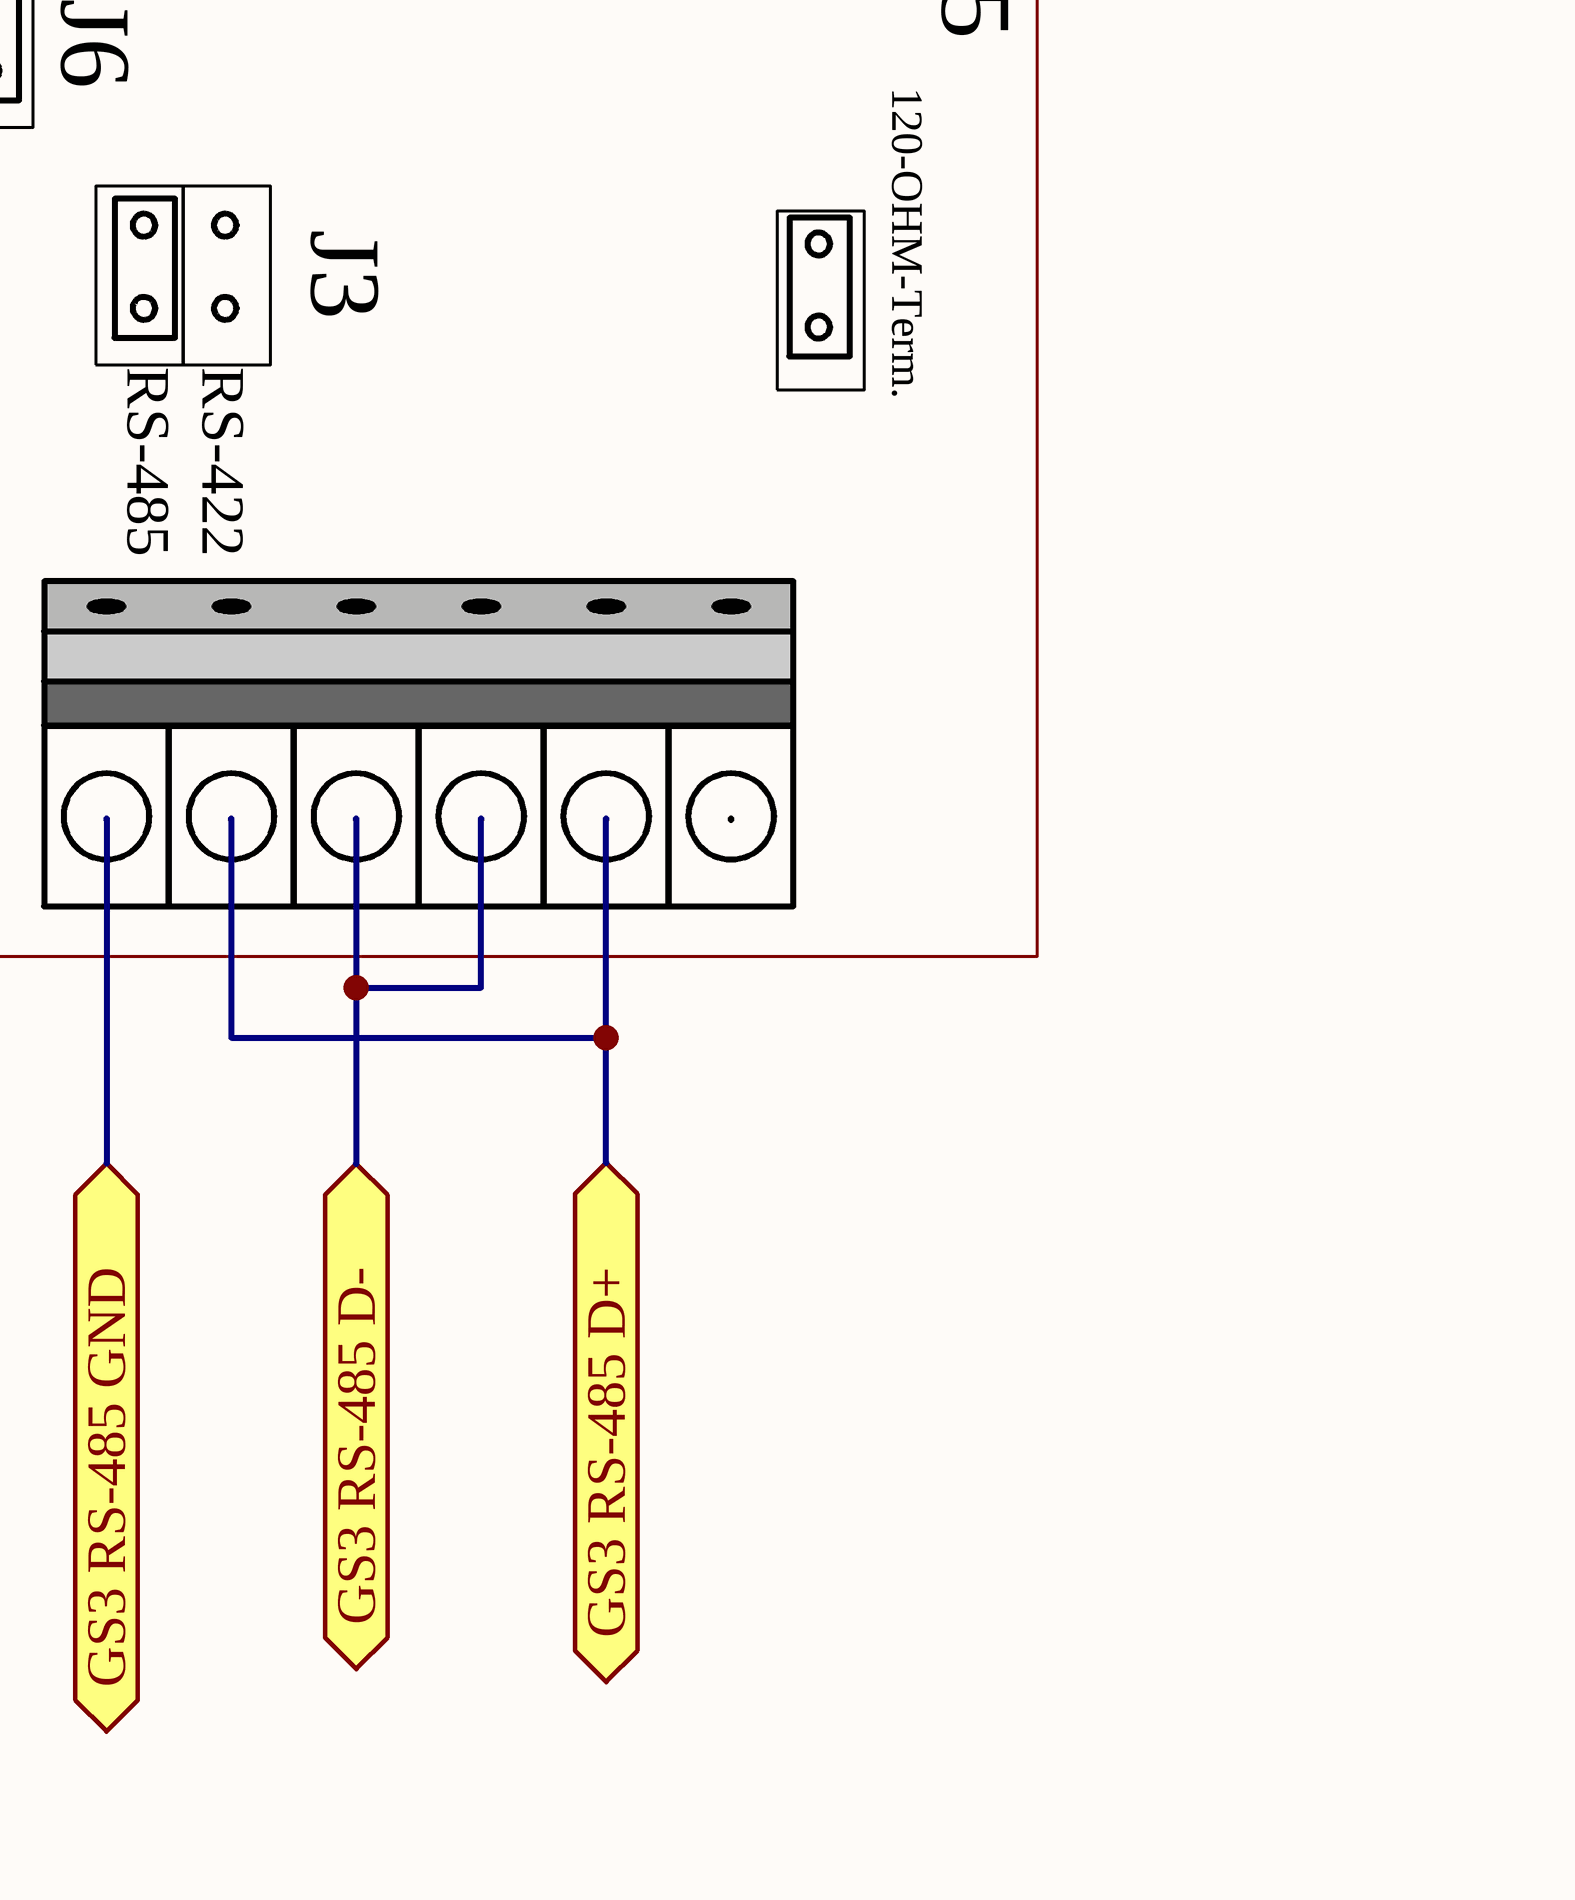
[diagram p9: LVM main.SchDoc, bottom column 2 of 4]
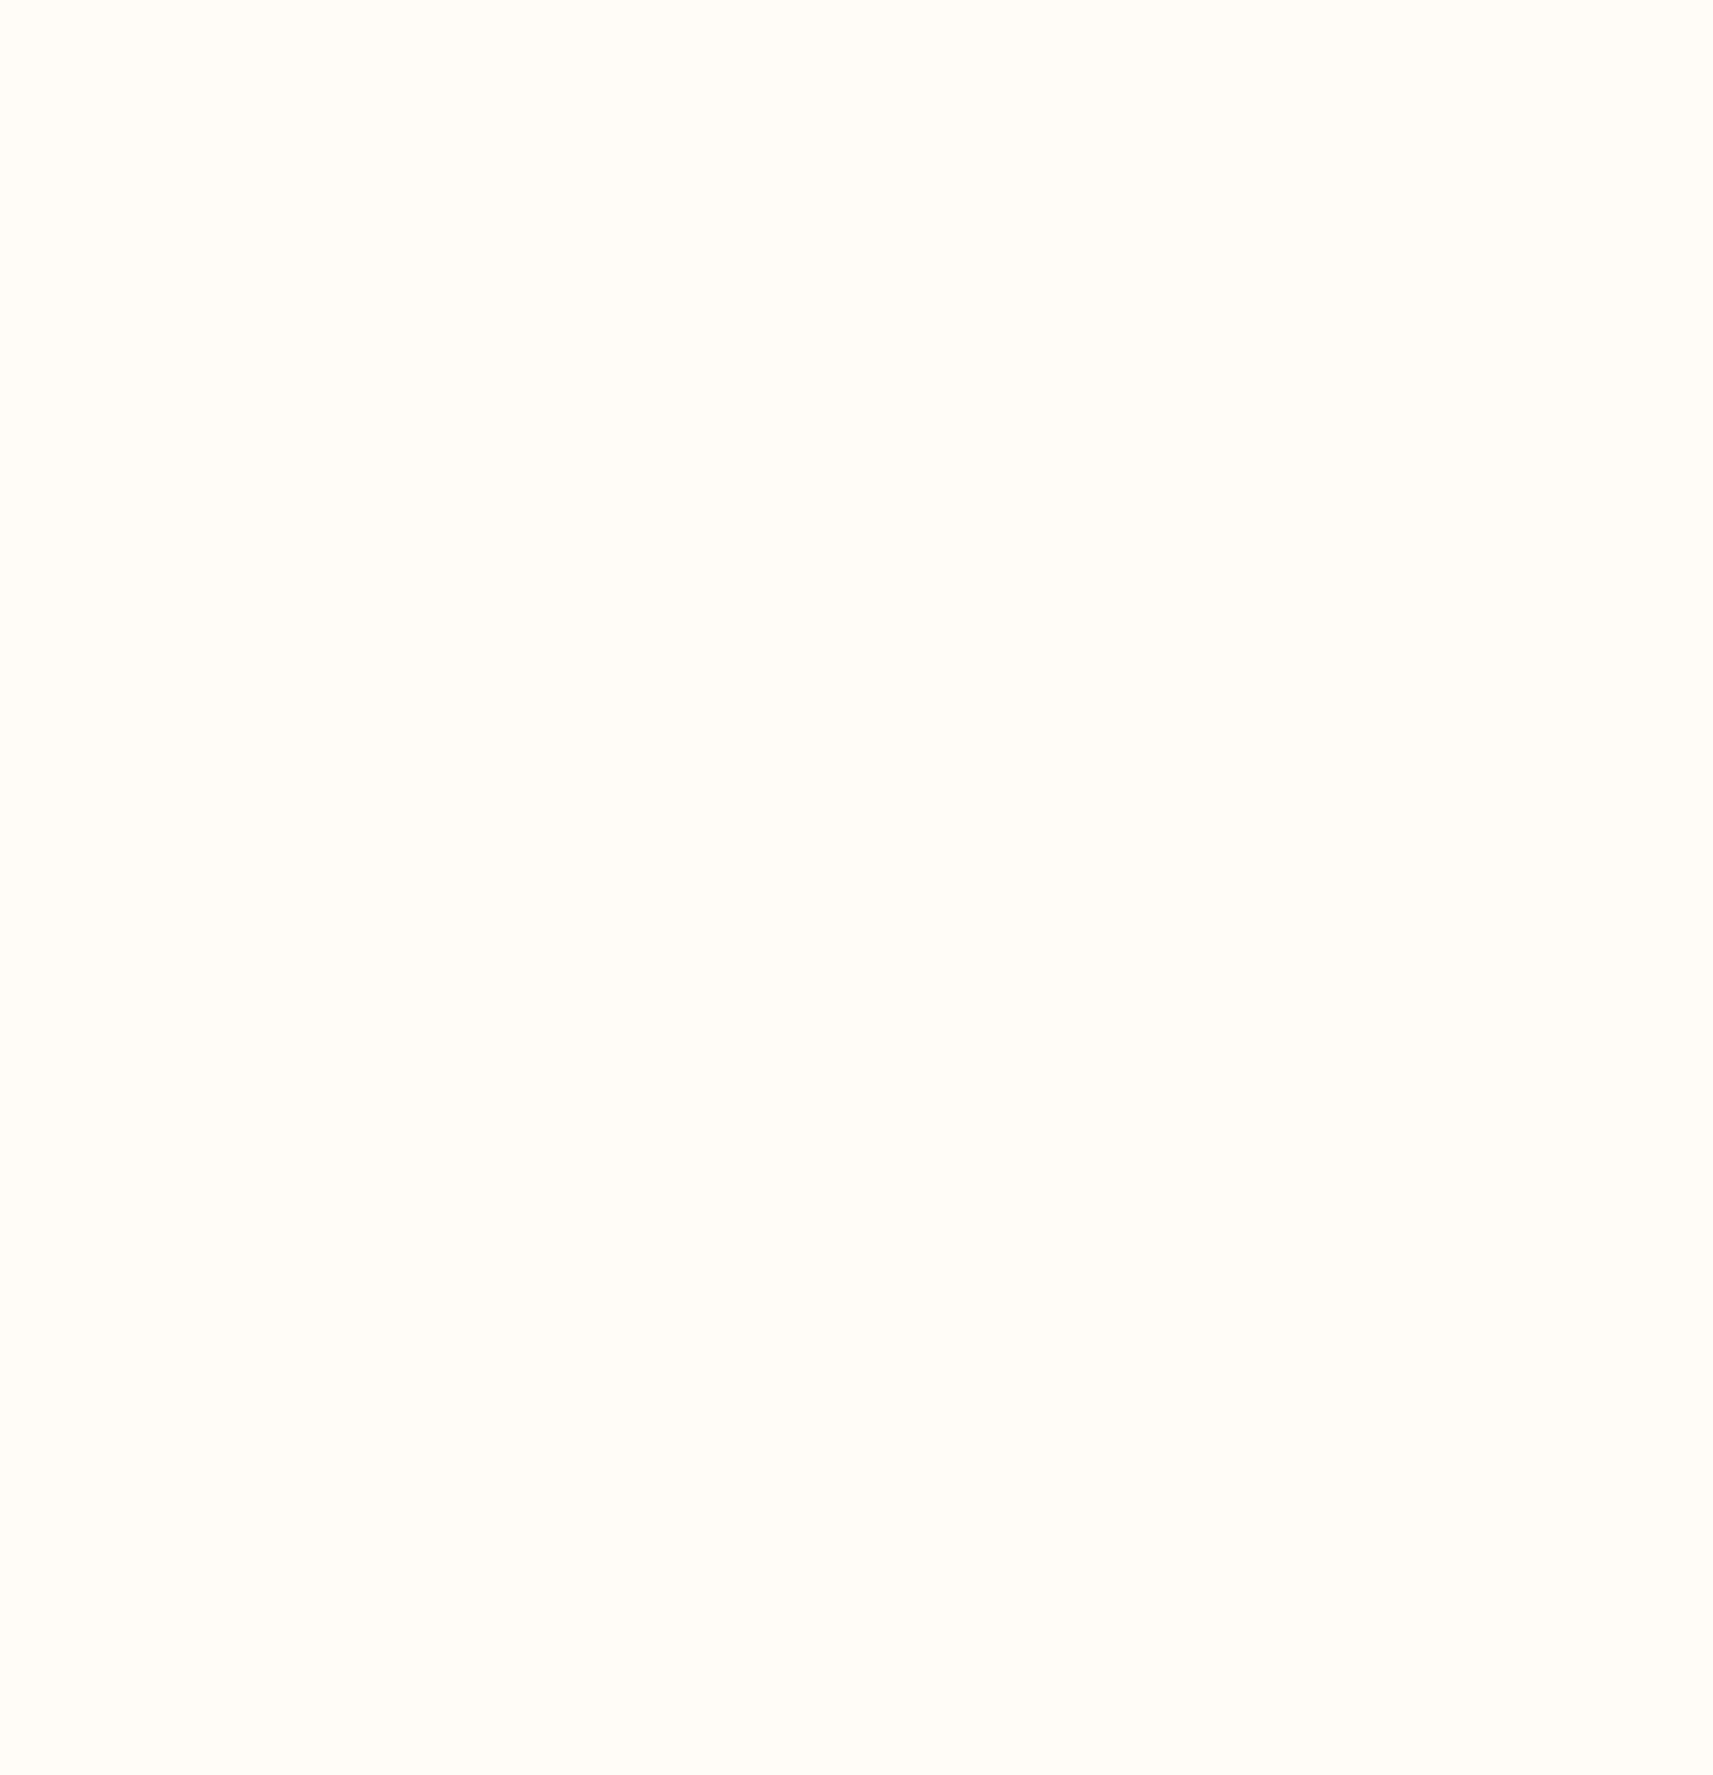
[diagram p10: LVM main.SchDoc, bottom column 4 of 4]

## Parts
(Parts that share a designator on the sheet are numbered #1, #2 ... from top to bottom, then left to right.)
1  H2-DM1E  (value not drawn)
*2  F2-16TD1P  (value not drawn)
*3  H2-CTRIO2  (value not drawn)
*4  H2-SERIO-4  (value not drawn)
*5  Parameter 1: D2-06BDC-1  (hidden comment: D2-0xBDC-1 DL205 PLC Base)
?#1  (no value)
?#2  F2-UNICON

## Ports
GS3 RS-485 D+ (bidir), GS3 RS-485 D- (bidir), GS3 RS-485 GND (bidir), ODH RS-485 D+ (bidir), ODH RS-485 D- (bidir), ODH RS-485 GND (bidir)

## Nets
GS3 RS-485 D+: ?#2.?2(RS-4xx_TX+) ?#2.?5(RS-4xx_RX+) ; port GS3 RS-485 D+
GS3 RS-485 D-: ?#2.?3(RS-4xx_TXD-) ?#2.?4(RS-4xx_RXD-) ; port GS3 RS-485 D-
GS3 RS-485 GND: ?#2.?1(RS-4xx_GND) ; port GS3 RS-485 GND
ODH RS-485 D+: *4.?4(RXD+_(D+)) ; port ODH RS-485 D+
ODH RS-485 D-: *4.?3(RXD-_(D-)) ; port ODH RS-485 D-
ODH RS-485 GND: *4.?5(GND) ; port ODH RS-485 GND
Net1_?1: 1.?1(CTS) ?#2.?7(CTS)
Net1_?2: 1.?2(RTS) ?#2.?8(RTS)
Net1_?3: 1.?3(TXD) ?#2.?9(TXD)
Net1_?4: 1.?4(RXD) ?#2.?10(RXD)
Net1_?5: 1.?5(+5V) ?#2.?11(+5V)
Net1_?6: 1.?6(GND) ?#2.?12(GND)

Not connected (* = marked no-connect by the designer): *2 ?1(A0) ?2(A1) ?3(A4) ?4(A5) ?5(A2) ?6(A6) ?7(A3) ?8(A7) ?9(24V) ?10(0V) ?11(B0) ?12(B1) ?13(B4) ?14(B2) ?15(B5) ?16(B3) ?17(B6) ?18(B7) ?19(0V); *4 ?1(TXD+) ?2(TXD-); *5 0(6) 1(6) 2(6) 3(6) 4(6) 5(6); ?#2 ?6(5V)

## Notes on the sheet
- (in symbol D2-0xBDC-1 DL205 PLC Base) Direct; LOGIC; Koyo; 12-24 VDC; 25 W; G; 12/24 VDC
- (in symbol D2-32ND) IN; 24; VDC; ACT; D2-32ND3; A0; A4; A1; A5; A2; A6; A3; A7; CI; B0; B4; B1; B5; B2; B6; B3; B7; CII; C0; C4; C1; C5; C2; C6; C7; C3; CIII; D0; D4; D1; D5; D2; D6; D3; D7; CIV; 22-26VDC; 4-6mA; CLASS2
- (in symbol F2-16TD1P) 12-24 VDC; OUT; VDC; 10.2-26.4; VDC 0.25A; CLASS 2; A; 0; 4; 1; 5; 2; 6; 3; 7; B
- (in symbol F2-UNICON) NETWORK; RXD FROM; TXD TO; ENABLE; '+' Bias; J5; '-' Bias; J6; 120-OHM-Term.; J3; RS-485; RS-422
- (in symbol H2-CTRIO2) +24 VDC; CTR; IN; OUTPUTS; IN 9-30 VDC 5-12 mA; OUT 5-36 VDC; 1.0 A max; per point; 1A; 2A; 1B; 2B; 1C; 2C; 1D; 2D; 1M; 2M; NC; C2; C0; Y2; Y0; C3; C1; Y3; Y1
- (in symbol H2-DM1E) PWR; ETH; RUN; USB; ROM; TX; ERR; RX; TERM; Do>; STOP; more; PGM; PORT; 6; 5; RS-232; 4; 3; SERIAL; 2; E; T; 0; H; /; R; N
- (in symbol H2-SERIO-4) RCV A; XMT A; RCV B; XMT B; RCV C; XMT C; SERIAL PORTS; A; RS-232; B; (D-) RXD-; (D+) RXD+

## Library data of the parts
?#1 = D2-32ND